# Altium schematic sheet SMA_Connector.SchDoc: SMA Connector
size A4
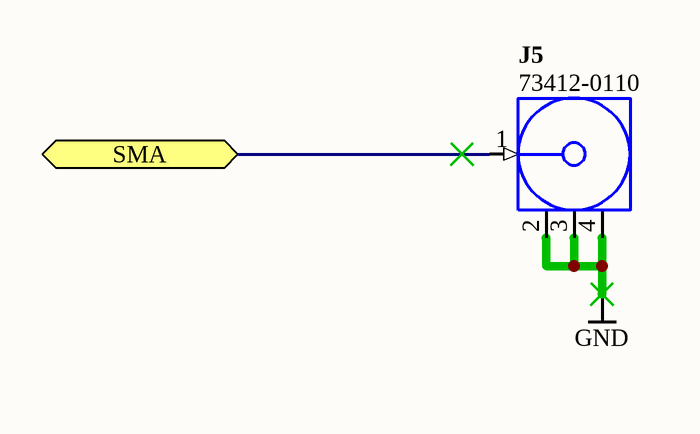
[diagram p0: SMA_Connector.SchDoc]

## Parts
J5  73412-0110  [MOLX-73412-0110]

## Ports
SMA (bidir)

## Nets
GND: J5.2(GND) J5.3(GND) J5.4(GND)
SMA: J5.1(Signal) ; port SMA

## Notes on the sheet
- Sheet Title
- Project Title
- Size:
- Date:
- A4
- Item:
- Time:
- Revision:
- Sheet
- of
- File:

## Library data of the parts
J5 = CMP-5222-00000-1: Microcoaxial RF, 50 Ohm, PCB Vertical Jack Receptacle, SMT, 1.25mm Mounted Height; Sub-class: Serial Bus; IEC-class: Connector; Body Length: 4 mm; Datasheet: http://www.molex.com/webdocs/datasheets/pdf/en-us/0734120110_RF_COAX_CONNECTORS.pdf; Terminal Pitch: 3 mm; Class: Connector